# EAGLE design ESC-1 (EAGLE 9.2.2)
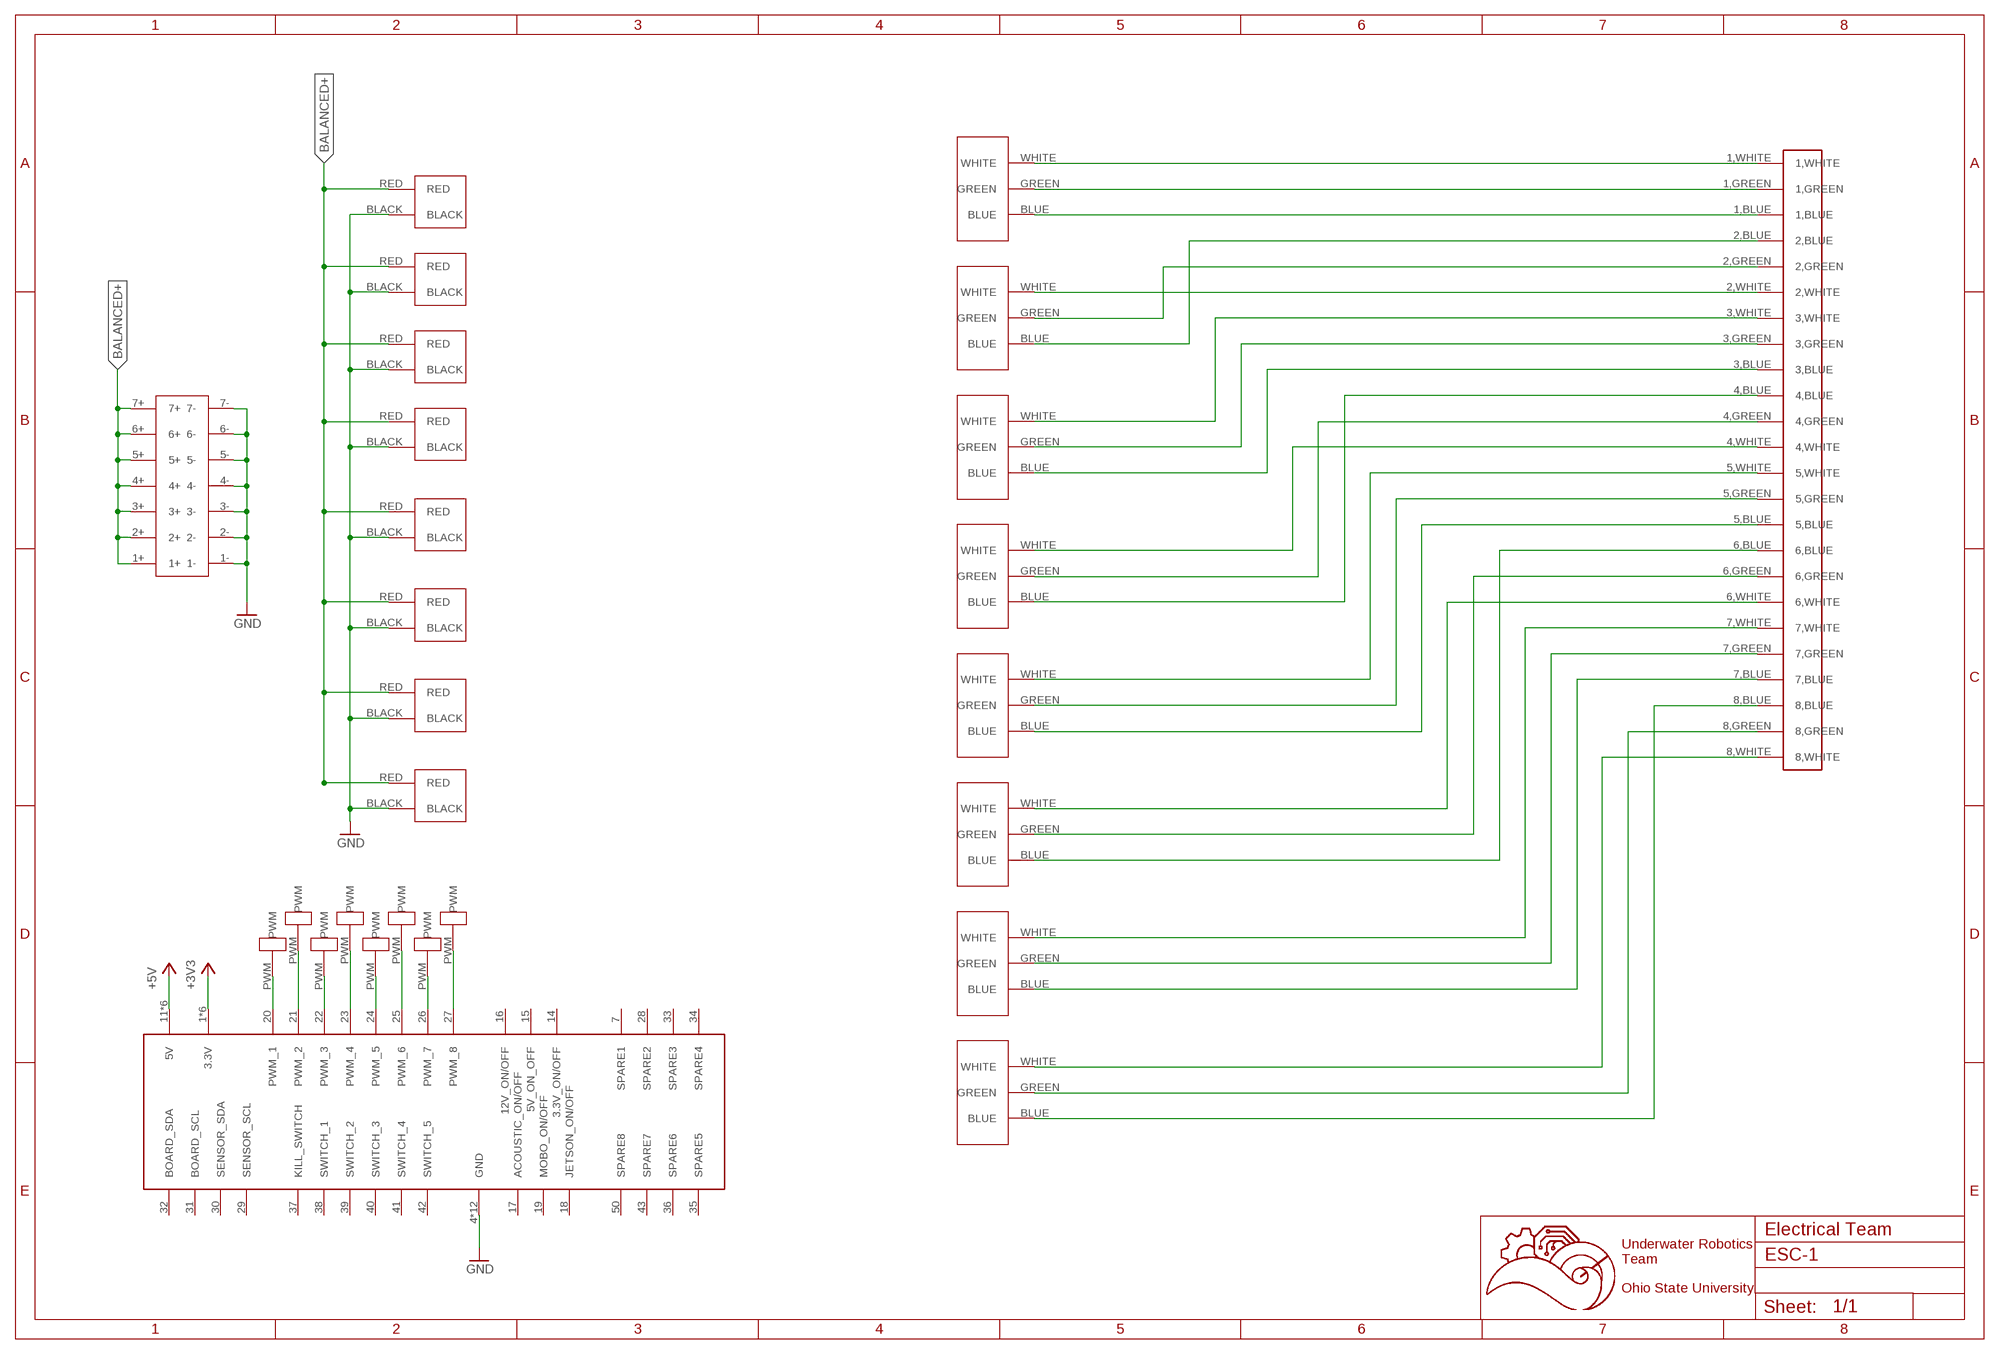
[diagram p0: schematic, sheet 1]

## Parts
1  1711738  [1711738]
2  1711738  [1711738]
3  1711738  [1711738]
4  1711738  [1711738]
5  1711738  [1711738]
6  1711738  [1711738]
7  1711738  [1711738]
8  1711738  [1711738]
U$1  5530843-EDGE  [5530843-6-BOARDFINGERS]
U$2  1711725  [1711725]
U$3  1711725  [1711725]
U$4  1711725  [1711725]
U$5  1711725  [1711725]
U$6  1711725  [1711725]
U$7  1711725  [1711725]
U$8  1711725  [1711725]
U$9  1711725  [1711725]
U$18  24PINCONVERTER  [24PINCONVERTER]
U$19  14PIN_VERT  [14PIN_VERT]
U$20  MALE1PINHEADER  [MALE1PINHEADER]
U$21  MALE1PINHEADER  [MALE1PINHEADER]
U$22  MALE1PINHEADER  [MALE1PINHEADER]
U$23  MALE1PINHEADER  [MALE1PINHEADER]
U$24  MALE1PINHEADER  [MALE1PINHEADER]
U$25  MALE1PINHEADER  [MALE1PINHEADER]
U$26  MALE1PINHEADER  [MALE1PINHEADER]
U$27  MALE1PINHEADER  [MALE1PINHEADER]

## Nets
+3V3: U$1.1(3.3V) U$1.2(3.3V) U$1.3(3.3V) U$1.54(3.3V) U$1.55(3.3V) U$1.56(3.3V)
+5V: U$1.11(5V) U$1.12(5V) U$1.13(5V) U$1.44(5V) U$1.45(5V) U$1.46(5V)
BALANCED+: U$2.RED U$3.RED U$4.RED U$5.RED U$6.RED U$7.RED U$8.RED U$9.RED U$19.1+ U$19.2+ U$19.3+ U$19.4+ U$19.5+ U$19.6+ U$19.7+
GND: U$1.4(GND) U$1.5(GND) U$1.6(GND) U$1.8(GND) U$1.9(GND) U$1.10(GND) U$1.47(GND) U$1.48(GND) U$1.49(GND) U$1.51(GND) U$1.52(GND) U$1.53(GND) U$2.BLACK U$3.BLACK U$4.BLACK U$5.BLACK U$6.BLACK U$7.BLACK U$8.BLACK U$9.BLACK U$19.1- U$19.2- U$19.3- U$19.4- U$19.5- U$19.6- U$19.7-
N$1: 1.WHITE U$18.1,WHITE
N$2: 1.GREEN U$18.1,GREEN
N$3: 1.BLUE U$18.1,BLUE
N$4: 2.WHITE U$18.2,WHITE
N$5: 2.GREEN U$18.2,GREEN
N$6: 2.BLUE U$18.2,BLUE
N$7: 3.WHITE U$18.3,WHITE
N$8: 3.GREEN U$18.3,GREEN
N$9: 3.BLUE U$18.3,BLUE
N$10: 4.WHITE U$18.4,WHITE
N$11: 4.GREEN U$18.4,GREEN
N$12: 4.BLUE U$18.4,BLUE
N$13: 5.WHITE U$18.5,WHITE
N$14: 5.GREEN U$18.5,GREEN
N$15: 5.BLUE U$18.5,BLUE
N$16: 6.BLUE U$18.6,BLUE
N$17: 6.WHITE U$18.6,WHITE
N$18: 6.GREEN U$18.6,GREEN
N$19: 7.WHITE U$18.7,WHITE
N$20: 7.GREEN U$18.7,GREEN
N$21: 7.BLUE U$18.7,BLUE
N$22: 8.WHITE U$18.8,WHITE
N$23: 8.GREEN U$18.8,GREEN
N$24: 8.BLUE U$18.8,BLUE
PWM_1: U$1.20(PWM_1) U$20.PWM
PWM_2: U$1.21(PWM_2) U$21.PWM
PWM_3: U$1.22(PWM_3) U$22.PWM
PWM_4: U$1.23(PWM_4) U$23.PWM
PWM_5: U$1.24(PWM_5) U$24.PWM
PWM_6: U$1.25(PWM_6) U$25.PWM
PWM_7: U$1.26(PWM_7) U$26.PWM
PWM_8: U$1.27(PWM_8) U$27.PWM
Unconnected: U$1.7(SPARE1) U$1.14(3.3V_ON/OFF) U$1.15(5V_ON_OFF) U$1.16(12V_ON/OFF) U$1.17(ACOUSTIC_ON/OFF) U$1.18(JETSON_ON/OFF) U$1.19(MOBO_ON/OFF) U$1.28(SPARE2) U$1.29(SENSOR_SCL) U$1.30(SENSOR_SDA) U$1.31(BOARD_SCL) U$1.32(BOARD_SDA) U$1.33(SPARE3) U$1.34(SPARE4) U$1.35(SPARE5) U$1.36(SPARE6) U$1.37(KILL_SWITCH) U$1.38(SWITCH_1) U$1.39(SWITCH_2) U$1.40(SWITCH_3) U$1.41(SWITCH_4) U$1.42(SWITCH_5) U$1.43(SPARE7) U$1.50(SPARE8)

## Notes on the sheet
- Electrical Team
- Underwater Robotics
  Team
  
  Ohio State University

## Library data of the parts
1-8 = Screw_Terminals:1711738
U$1 = 5530843-6:5530843-EDGE
U$2-U$9 = Screw_Terminals:1711725: 2-pin screw terminal
U$18 = 24_Pin_Connector:24PINCONVERTER
U$19 = 14_Pin_Connector_Vert:14PIN_VERT
U$20-U$27 = Male_Header_1Pin:MALE1PINHEADER

## Board
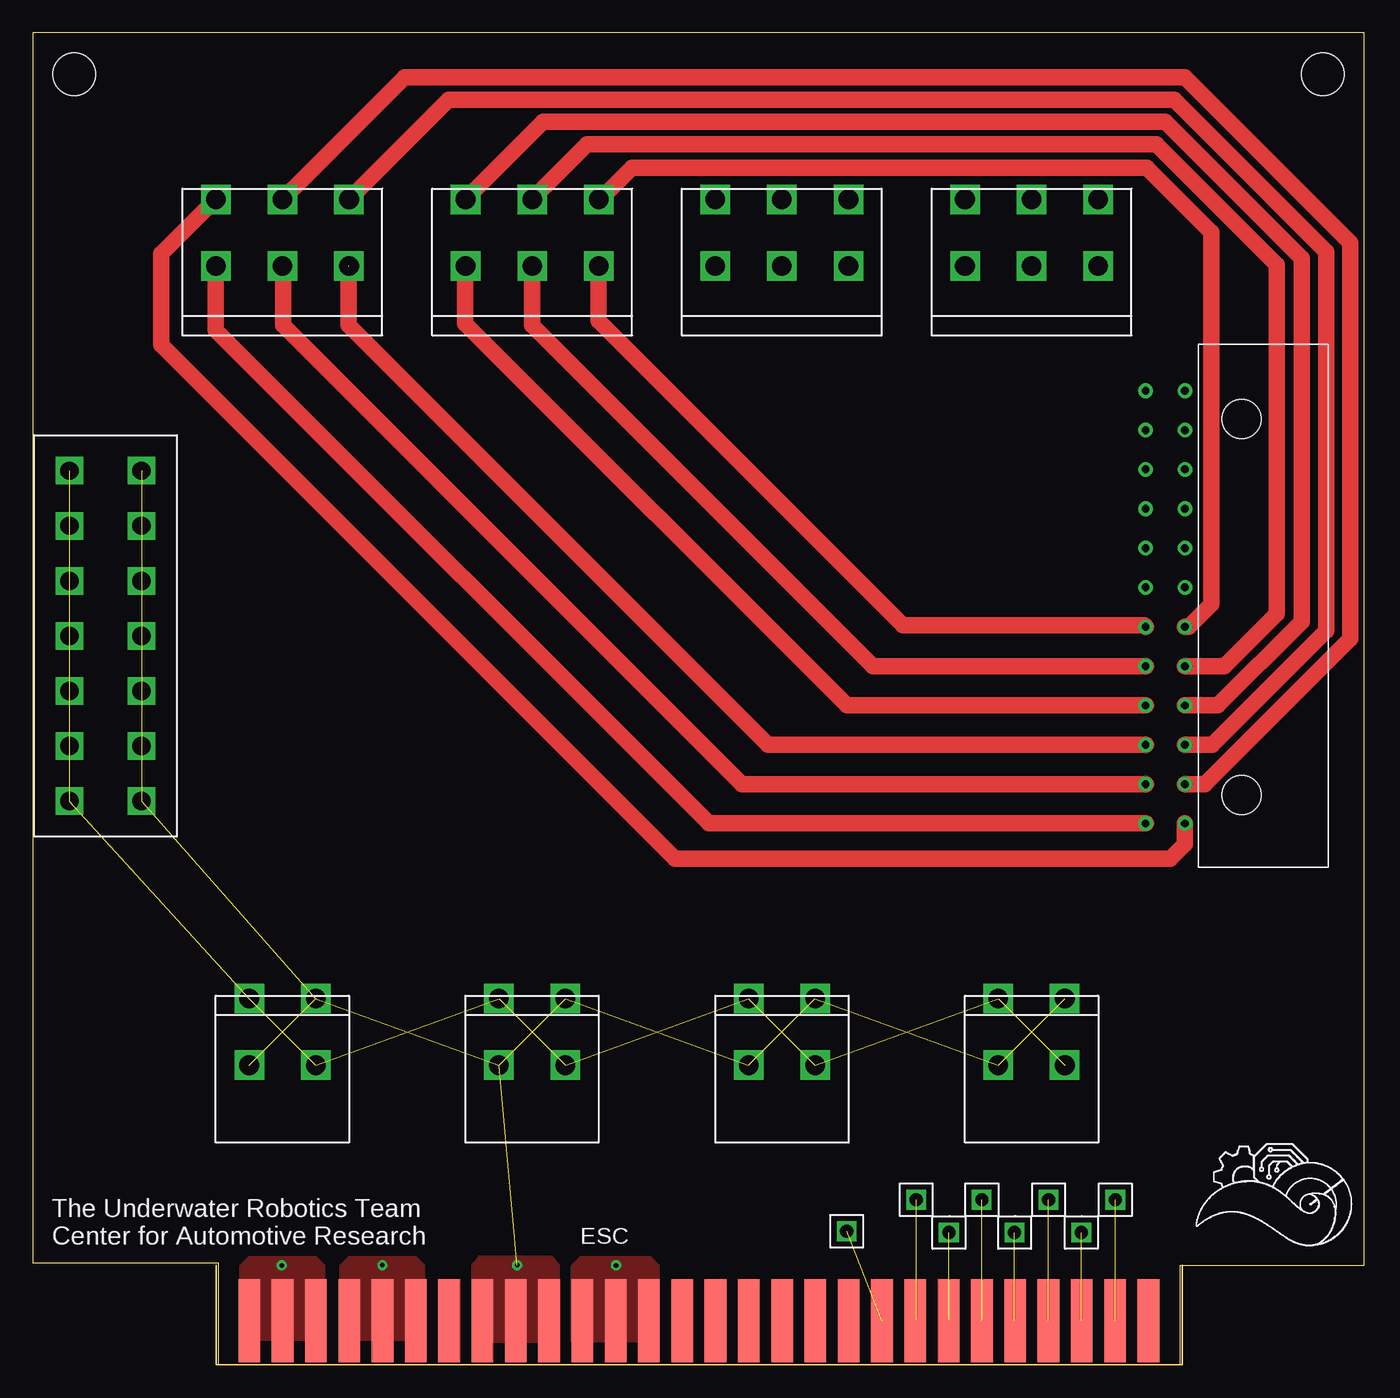
[diagram p1: board, top side]
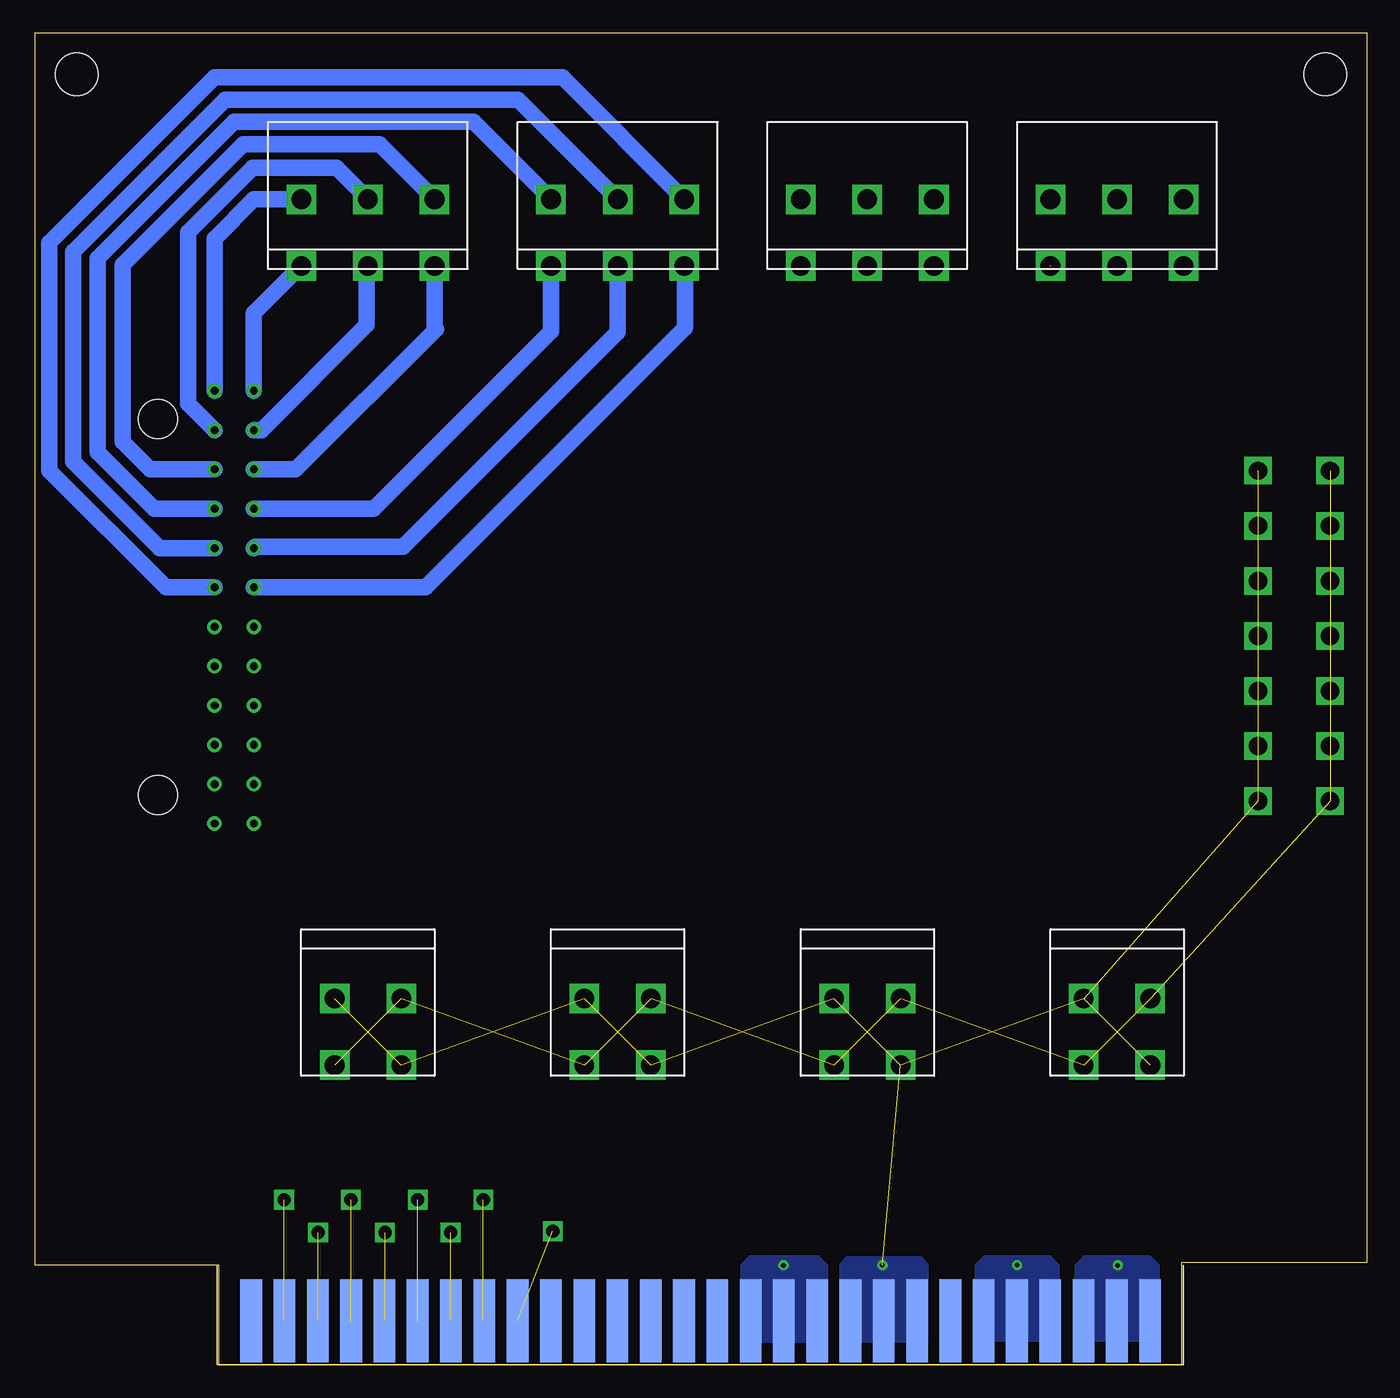
[diagram p2: board, bottom side, seen from below]

Size 101.6 x 101.6 mm. Coordinates in mm from the lower left corner, seen from the top.
Outline: 0,7.8 14.14,7.8 14.14,0 87.53,0 87.53,7.62 101.6,7.62 101.6,101.6 0,101.6 0,7.8
Copper layers (1*16): Top 0.035mm / dielectric 1.5mm / Bottom 0.035mm
Design rules "default *": minimum track width 6mil, minimum drill 0.35mm, track to track 6mil, track to pad 6mil, pad to pad 6mil, via to via 6mil, smd to smd 6mil, copper to edge 0.00508125mm, drill to drill 6mil, minimum pad ring 10mil, minimum via ring 8mil, stop-mask expansion 4mil, vias tented up to drill 0mil, thermal gap 10mil
Holes 3.26 mm at 3.17,98.42 98.42,98.42

### Footprints (pad centres in the part's own frame; a part is rotated, then mirrored left to right if it is on the bottom)
1711738 = drill 1.5 square: BLUE -5.08,0; GREEN 0,0; WHITE 5.08,0
5530843-6-BOARDFINGERS = smd 1.651 x 6.35 bottom: 1 0.826,3.375; 2 3.365,3.375; 3 5.905,3.375; 4 8.445,3.375; 5 10.986,3.375; 6 13.525,3.375; 7 16.066,3.375; 8 18.605,3.375; 9 21.145,3.375; 10 23.686,3.375; 11 26.226,3.375; 12 28.765,3.375; 13 31.305,3.375; 14 33.846,3.375; 15 36.386,3.375; 16 38.925,3.375; 17 41.465,3.375; 18 44.005,3.375; 19 46.545,3.375; 20 49.086,3.375; 21 51.626,3.375; 22 54.166,3.375; 23 56.706,3.375; 24 59.245,3.375; 25 61.785,3.375; 26 64.326,3.375; 27 66.865,3.375; 28 69.406,3.375 | smd 1.651 x 6.35: 29 69.406,3.375; 30 66.865,3.375; 31 64.326,3.375; 32 61.785,3.375; 33 59.245,3.375; 34 56.706,3.375; 35 54.166,3.375; 36 51.626,3.375; 37 49.086,3.375; 38 46.545,3.375; 39 44.005,3.375; 40 41.465,3.375; 41 38.925,3.375; 42 36.386,3.375; 43 33.846,3.375; 44 31.305,3.375; 45 28.765,3.375; 46 26.226,3.375; 47 23.686,3.375; 48 21.145,3.375; 49 18.605,3.375; 50 16.066,3.375; 51 13.525,3.375; 52 10.986,3.375; 53 8.445,3.375; 54 5.905,3.375; 55 3.365,3.375; 56 0.826,3.375
1711725 = drill 1.5 square: BLACK -2.54,0; RED 2.54,0
24PINCONVERTER = drill 0.6: 1,BLUE 0,27; 1,GREEN 0,30; 1,WHITE 0,33; 2,BLUE 3,33; 2,GREEN 3,30; 2,WHITE 3,27; 3,BLUE 0,18; 3,GREEN 0,21; 3,WHITE 0,24; 4,BLUE 3,24; 4,GREEN 3,21; 4,WHITE 3,18; 5,BLUE 0,9; 5,GREEN 0,12; 5,WHITE 0,15; 6,BLUE 3,15; 6,GREEN 3,12; 6,WHITE 3,9; 7,BLUE 0,0; 7,GREEN 0,3; 7,WHITE 0,6; 8,BLUE 3,6; 8,GREEN 3,3; 8,WHITE 3,0 | hole 3: 7.32,2.16; 7.32,30.84
14PIN_VERT = drill 1.4 square: 1+ 0,0; 1- 5.5,0; 2+ 0,4.2; 2- 5.5,4.2; 3+ 0,8.4; 3- 5.5,8.4; 4+ 0,12.6; 4- 5.5,12.6; 5+ 0,16.8; 5- 5.5,16.8; 6+ 0,21; 6- 5.5,21; 7+ 0,25.2; 7- 5.5,25.2
MALE1PINHEADER = drill 1 square: PWM 0,0

### Placement (x,y rotation side)
1  76.2,83.82 0 top
2  76.2,88.9 0 bottom
3  57.15,83.82 0 top
4  57.15,88.9 0 bottom
5  38.1,83.82 0 top
6  38.1,88.9 0 bottom
7  19.05,83.82 0 top
8  19.05,88.9 0 bottom
U$1  15.7,0 0 top
U$2  76.2,22.86 0 top
U$3  38.1,22.86 0 top
U$4  38.1,27.94 0 bottom
U$5  76.2,27.94 0 bottom
U$6  57.15,27.94 0 bottom
U$7  19.05,27.94 0 bottom
U$8  19.05,22.86 0 top
U$9  57.15,22.86 0 top
U$18  84.9,41.3 0 top
U$19  2.8,43 0 top
U$20  62.1,10.2 0 top
U$21  67.4,12.6 0 top
U$22  69.9,10.1 0 top
U$23  72.4,12.6 0 top
U$24  74.9,10.1 0 top
U$25  77.5,12.6 0 top
U$26  80,10.1 0 top
U$27  82.6,12.6 0 top

### Tracks (layer width: path | path; a pad name or v marks a point on that pad's centre or on a via)
+3V3  (via drill 0.35)
  other vias: 19,7.6
  pour Bottom (no thermals): 15.88,7.62 16.51,8.26 21.59,8.26 22.23,7.62 22.23,1.91 15.88,1.91
  pour Top (no thermals): 15.88,7.62 16.51,8.26 21.59,8.26 22.23,7.62 22.23,1.91 15.88,1.91
+5V  (via drill 0.35)
  other vias: 44.5,7.6
  pour Top (no thermals): 41.15,1.78 41.15,7.62 41.78,8.26 47.12,8.26 47.75,7.62 47.75,1.78
  pour Bottom (no thermals): 41.15,1.78 41.15,7.62 41.78,8.26 47.12,8.26 47.75,7.62 47.75,1.78
BALANCED+  (14 unrouted)
GND  (via drill 0.35)  (15 unrouted)
  other vias: 26.67,7.62 36.96,7.62
  pour Top (no thermals): 23.5,7.62 24.13,8.26 29.21,8.26 29.84,7.62 29.84,1.91 23.5,1.91
  pour Bottom (no thermals): 23.5,7.62 24.13,8.26 29.21,8.26 29.84,7.62 29.84,1.91 23.5,1.91
  pour Top (no thermals): 33.66,1.78 40.13,1.78 40.13,7.62 39.62,8.26 34.04,8.26 33.53,7.62 33.53,1.91
  pour Bottom (no thermals): 33.53,7.62 33.53,1.91 33.66,1.78 40.01,1.78 40.01,4.06 40.01,5.71 40.13,5.84 40.13,7.62 39.62,8.26 34.04,8.26
N$1
  Bottom 1.27: U$18.1,WHITE 84.9,80.2 1.WHITE
N$2
  Bottom 1.27: 1.GREEN 76.3,83.72 76.3,79.32 84.32,71.3 U$18.1,GREEN
N$3
  Bottom 1.27: 84.7,68.3 U$18.1,BLUE 81.7,68.3 71,79 71.12,79.12 1.BLUE
N$4
  Bottom 1.27: U$18.2,WHITE 92.8,68.3 94.9,70.4 94.9,83.9 85.7,93.1 75.32,93.1 2.WHITE
N$5
  Bottom 1.27: 2.GREEN 78.6,91.3 85,91.3 89.9,86.4 89.9,73.3 U$18.2,GREEN
N$6
  Bottom 1.27: U$18.2,BLUE 87.9,85.9 84.9,88.9 2.BLUE
N$7
  Bottom 1.27: U$18.3,WHITE 75.75,65.3 62.23,78.82 3.WHITE
N$8
  Bottom 1.27: 3.GREEN 57.15,78.75 73.5,62.4 84.8,62.4 U$18.3,GREEN
N$9
  Bottom 1.27: U$18.3,BLUE 71.8,59.3 52,79.1 52,83.75 3.BLUE
N$10
  Bottom 1.27: 4.WHITE 61.37,98.2 87.9,98.2 100.5,85.6 100.5,68.2 91.6,59.3 U$18.4,WHITE
N$11
  Bottom 1.27: 4.GREEN 64.75,96.5 87.1,96.5 98.7,84.9 98.7,68.9 92.1,62.3 U$18.4,GREEN
N$12
  Bottom 1.27: 4.BLUE 68.13,94.8 86.4,94.8 96.8,84.4 96.8,69.6 92.5,65.3 U$18.4,BLUE
N$13
  Top 1.27: 5.WHITE 43.18,79.62 66.4,56.4 84.8,56.4 U$18.5,WHITE
N$14
  Top 1.27: U$18.5,GREEN 64.1,53.3 38.1,79.3 5.GREEN
N$15
  Top 1.27: U$18.5,BLUE 62.1,50.3 33,79.4 33,83.8 5.BLUE
N$16
  Top 1.27: 6.BLUE 43.3,88.9 45.7,91.3 85,91.3 89.9,86.4 89.9,58 88.2,56.3 U$18.6,BLUE
N$17
  Top 1.27: 6.WHITE 38.92,94.8 86.4,94.8 96.8,84.4 96.8,56.7 90.4,50.3 U$18.6,WHITE
N$18
  Top 1.27: 6.GREEN 42.3,93.1 85.7,93.1 94.9,83.9 94.9,57.3 90.9,53.3 U$18.6,GREEN
N$19  (1 unrouted)
  Top 1.27: U$18.7,WHITE 56.1,47.3 24.1,79.3 24.1,83.8 23.7,84.2
N$20
  Top 1.27: U$18.7,GREEN 54.1,44.3 19.1,79.3 19.1,83.77 7.GREEN
N$21
  Top 1.27: 7.BLUE 13.97,78.93 51.6,41.3 U$18.7,BLUE
N$22
  Top 1.27: U$18.8,WHITE 87.9,39.7 86.8,38.6 49,38.6 9.8,77.8 9.8,84.73 8.WHITE
N$23
  Top 1.27: 8.GREEN 28.35,98.2 87.9,98.2 100.5,85.6 100.5,55.4 89.4,44.3 U$18.8,GREEN
N$24
  Top 1.27: 8.BLUE 31.73,96.5 87.1,96.5 98.7,84.9 98.7,56 90,47.3 U$18.8,BLUE
PWM_1  (1 unrouted)
  Bottom 1.27: 64.8,2.4 64.8,3.36 U$1.20
PWM_2  (1 unrouted)
  Bottom 1.27: 67.4,3.45 U$1.21
PWM_3  (1 unrouted)
  Bottom 1.27: 69.9,3.41 U$1.22
PWM_4  (1 unrouted)
  Bottom 1.27: U$1.23
PWM_5  (1 unrouted)
  Bottom 1.27: 74.9,3.42 U$1.24
PWM_6  (1 unrouted)
  Bottom 1.27: U$1.25
PWM_7  (1 unrouted)
  Bottom 1.27: 80,3.4 U$1.26
PWM_8  (1 unrouted)
  Bottom 1.27: 82.6,3.41 U$1.27

### Text on the board
tPlace: The Underwater Robotics Team / Center for Automotive Research | ESC